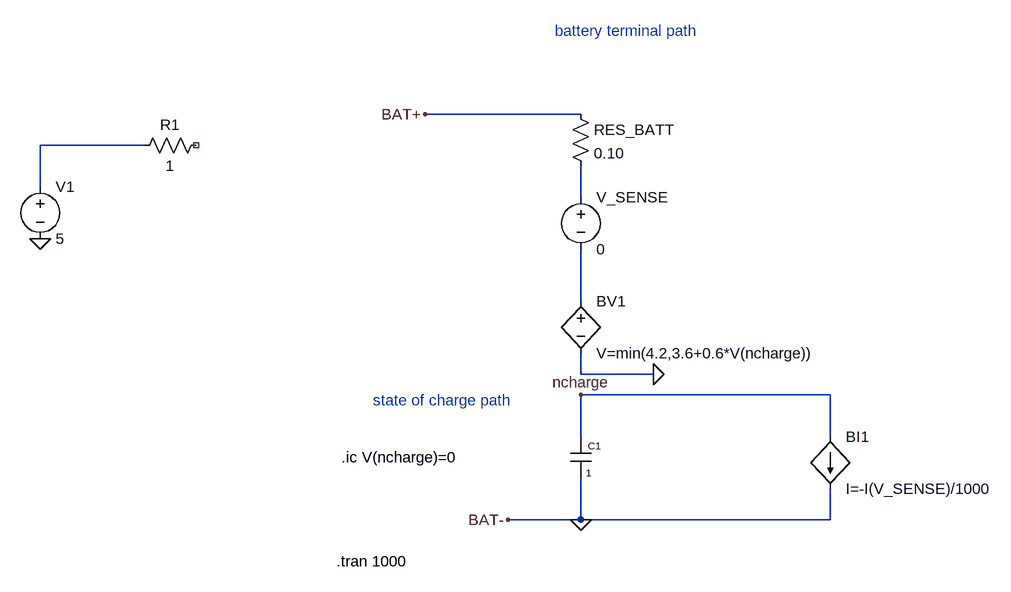
[diagram p0: schematic Battery_charged.asc]
Battery_charged.asc, the LTspice schematic file:
Version 4.1
SHEET 1 1604 680
WIRE 528 -112 288 -112
WIRE -144 -64 -304 -64
WIRE -304 0 -304 -64
WIRE 528 16 528 -32
WIRE 528 176 528 96
WIRE 528 288 528 256
WIRE 640 288 528 288
WIRE 912 320 528 320
WIRE 528 384 528 320
WIRE 912 384 912 320
WIRE 528 512 528 448
WIRE 528 512 416 512
WIRE 912 512 912 464
WIRE 912 512 528 512
FLAG 288 -112 BAT+
FLAG 528 320 ncharge
FLAG 528 512 0
FLAG 416 512 BAT-
FLAG 640 288 0
FLAG -304 80 0
DATAFLAG 544 304 ""
DATAFLAG 544 304 ""
SYMBOL bv 528 160 R0
SYMATTR InstName BV1
SYMATTR Value V=min(4.2,3.6+0.6*V(ncharge))
SYMBOL res 512 -128 R0
SYMATTR InstName RES_BATT
SYMATTR Value 0.10
SYMBOL cap 512 384 R0
WINDOW 0 27 14 Left 1
WINDOW 3 24 56 Left 1
SYMATTR InstName C1
SYMATTR Value 1
SYMBOL bi 912 384 R0
SYMATTR InstName BI1
SYMATTR Value I=-I(V_SENSE)/1000
SYMBOL voltage 528 0 R0
SYMATTR InstName V_SENSE
SYMATTR Value 0
SYMBOL voltage -304 -16 R0
SYMATTR InstName V1
SYMATTR Value 5
SYMBOL res -48 -80 R90
WINDOW 0 0 56 VBottom 2
WINDOW 3 32 56 VTop 2
SYMATTR InstName R1
SYMATTR Value 1
TEXT 160 416 Left 2 !.ic V(ncharge)=0
TEXT 488 -240 Left 2 ;battery terminal path
TEXT 208 328 Left 2 ;state of charge path
TEXT 152 576 Left 2 !.tran 1000

The netlist it stands for:
* Battery_charged.asc
BV1 N003 0 V=min(4.2,3.6+0.6*V(ncharge))
RES_BATT BAT+ N002 0.10
C1 ncharge 0 1
BI1 ncharge 0 I=-I(V_SENSE)/1000
V_SENSE N002 N003 0
V1 N001 0 5
R1 NC_01 N001 1
.ic V(ncharge)=0
* battery terminal path
* state of charge path
.tran 1000
.backanno
.end